# EAGLE design MM7150 (EAGLE 7.7.0)
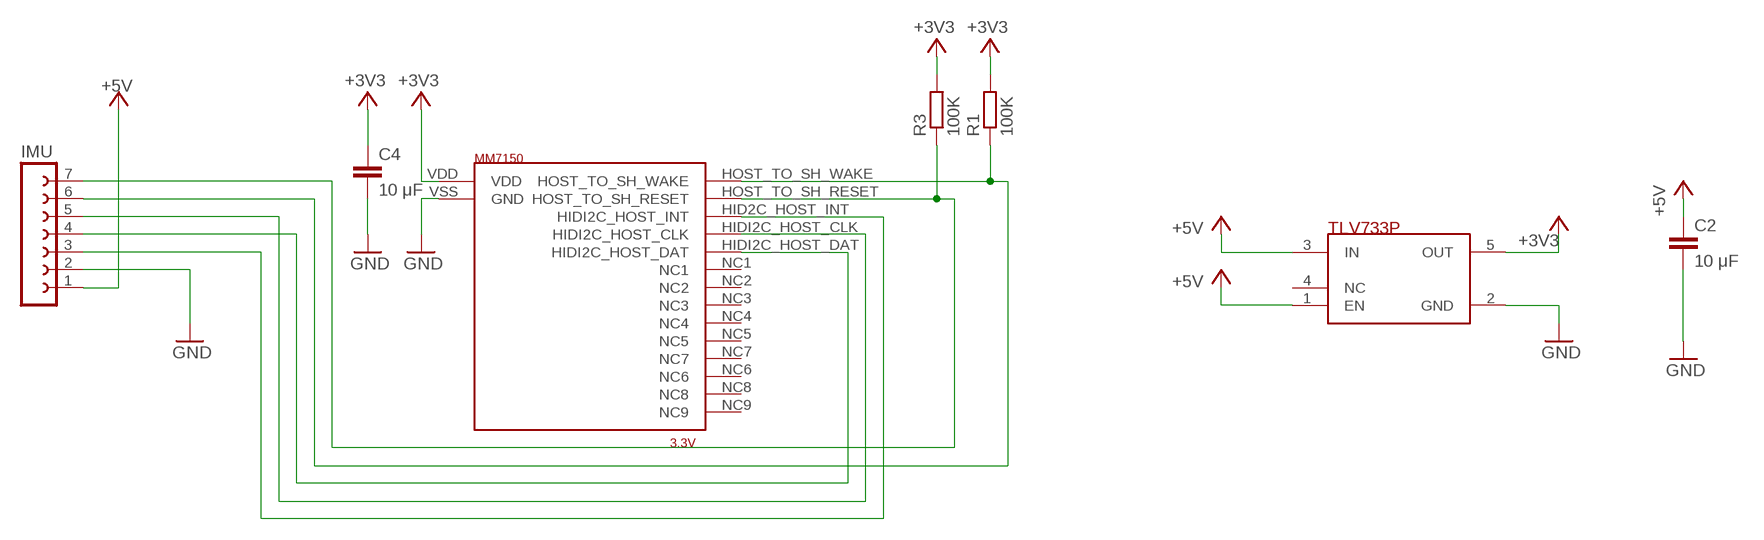
[diagram p0: schematic, sheet 1]

## Parts
C2  10 μF  C-EUC0805  [C0805]
C4  10 μF  C-EUC0805  [C0805]
IMU  FE07-1  [FE07]
R1  100K  R-EU_R2012  [R2012]
R3  100K  R-EU_R2012  [R2012]
U$1  MM7150  [MM7150]
U$2  TLV733P  [SOT23-5]

## Nets
$N3: IMU.3 U$1.HID2C_HOST_INT(HIDI2C_HOST_INT)
$N4: IMU.4 U$1.HIDI2C_HOST_DAT
$N5: IMU.5 U$1.HIDI2C_HOST_CLK
+3V3: C4.1 R1.2 R3.2 U$1.VDD U$2.5(OUT)
+5V: C2.1 IMU.1 U$2.1(EN) U$2.3(IN)
GND: C2.2 C4.2 IMU.2 U$1.VSS(GND) U$2.2(GND)
N$1: IMU.6 R1.1 U$1.HOST_TO_SH_WAKE
N$3: IMU.7 R3.1 U$1.HOST_TO_SH_RESET
Unconnected: U$1.NC1 U$1.NC2 U$1.NC3 U$1.NC4 U$1.NC5 U$1.NC6 U$1.NC7 U$1.NC8 U$1.NC9 U$2.4(NC)

## Library data of the parts
C2 C4 = rcl:C-EU: CAPACITOR, European symbol
IMU = con-lsta:FE07-1: FEMALE HEADER; OC_FARNELL: unknown; OC_NEWARK: unknown
R1 R3 = rcl:R-EU_: RESISTOR, European symbol
U$1 = MM7150:MM7150
U$2 = MM7150:TLV733P

## Board
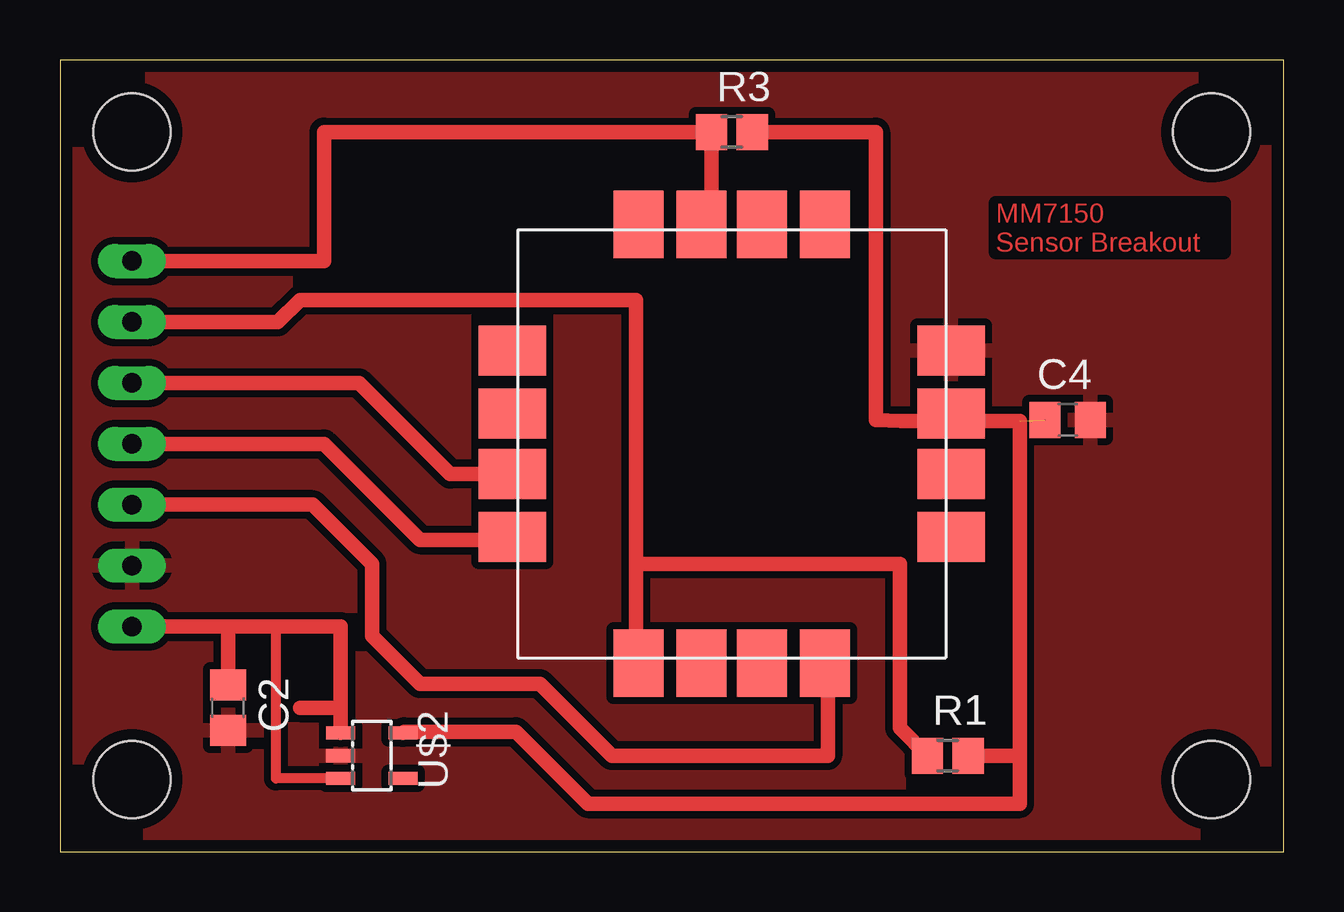
[diagram p1: board, top side]
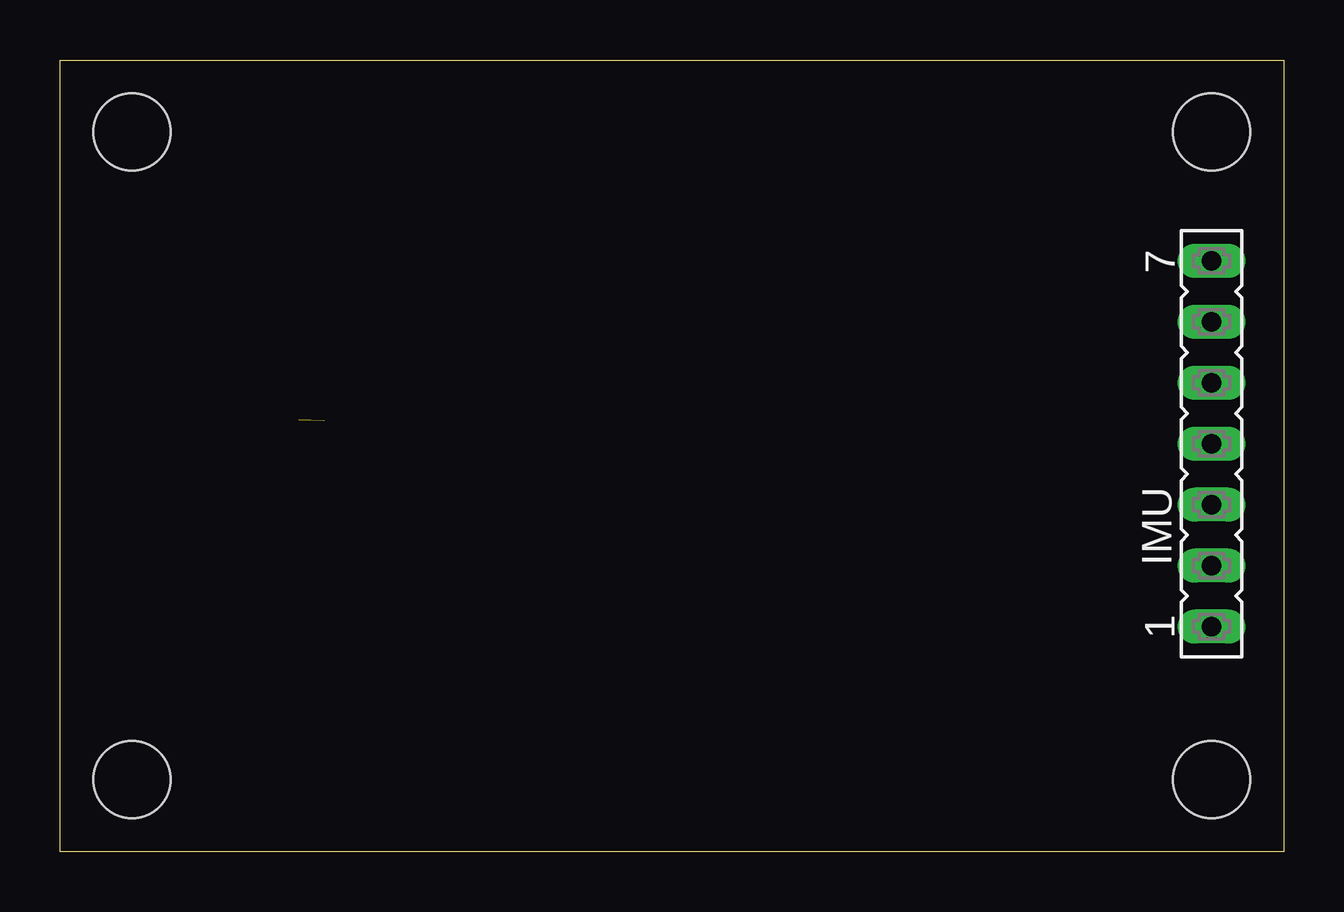
[diagram p2: board, bottom side, seen from below]

Size 51 x 33 mm. Coordinates in mm from the lower left corner, seen from the top.
Outline: 0,0 51,0 51,33 0,33 0,0
Copper layers (1*16): Top 0.035mm / dielectric 1.5mm / Bottom 0.035mm
Design rules "HVA-LPKF": minimum track width 0.3mm, minimum drill 0.6mm, track to track 0.3mm, track to pad 0.3mm, pad to pad 0.3mm, via to via 0.3mm, smd to smd 0.3mm, copper to edge 0.5mm, drill to drill 0.5mm, minimum pad ring 0.3mm, minimum via ring 0.3mm, stop-mask expansion 0.1mm, vias tented up to drill 0mil, thermal gap 0.3mm
Holes 3.2 mm at 3,3 48,3 48,30 3,30

### Footprints (pad centres in the part's own frame; a part is rotated, then mirrored left to right if it is on the bottom)
C0805 = smd 1.3 x 1.5: 1 -0.95,0; 2 0.95,0
FE07 = drill 0.813 long: 1 -7.62,0; 2 -5.08,0; 3 -2.54,0; 4 0,0; 5 2.54,0; 6 5.08,0; 7 7.62,0
R2012 = smd 1.3 x 1.5: 1 -0.85,0; 2 0.85,0
MM7150 = smd 2.08 x 2.8: HID2C_HOST_INT 3.88,-9.144; HOST_TO_SH_RESET -1.265,9.144; HOST_TO_SH_WAKE -3.88,-9.144; NC1 1.265,9.144; NC2 -1.265,-9.144; NC3 3.88,9.144; NC4 -3.88,9.144; NC7 1.265,-9.144 | smd 2.8 x 2.08: HIDI2C_HOST_CLK -9.144,-1.265; HIDI2C_HOST_DAT -9.144,-3.88; NC5 -9.144,3.88; NC6 -9.144,1.265; NC8 9.144,-3.88; NC9 9.144,-1.265; VDD 9.144,1.265; VSS 9.144,3.88
SOT23-5 = smd 0.55 x 1.2: 1 -0.95,-1.3; 2 0,-1.3; 3 0.95,-1.3; 4 0.95,1.3; 5 -0.95,1.3

### Placement (x,y rotation side)
C2  7,6 270 top
C4  42,18 0 top
IMU  3,17 90 bottom
R1  37,4 0 top
R3  28,30 0 top
U$1  28,17 0 top
U$2  13,4 270 top

### Tracks (layer width: path | path; a pad name or v marks a point on that pad's centre or on a via)
$N3
  Top 0.6: U$1.HID2C_HOST_INT 32,7.74 32,4 23,4 20,7 15,7 13,9 13,12 10.54,14.46 IMU.3
$N4
  Top 0.6: IMU.4 11,17 15,13 18.86,13 U$1.HIDI2C_HOST_DAT
$N5
  Top 0.6: U$1.HIDI2C_HOST_CLK 16.27,15.73 12.46,19.54 IMU.5
+3V3  (1 unrouted)
  Top 0.6: 37.46,17.95 40,17.95 40,4 | 37.46,17.95 U$1.VDD | 37.46,17.95 35.05,17.95 34,18 34,30 R3.2 | U$2.5 14.35,5 19,5 22,2 40,2 40,4 | R1.2 40,4
+5V
  Top 0.406: U$2.3 9,3.05 9,9.38
  Top 0.6: IMU.1 7,9.38 | 7,9.38 9,9.38 11.7,9.38 11.7,6 | 11.7,6 U$2.1 | C2.1 7,9.38 | 10,6 11.7,6
GND
  pour Top: 0,0 51,0 51,33 0,33
N$1
  Top 0.6: U$1.HOST_TO_SH_WAKE 24,7.86 24,12 | 24,12 24,23 10,23 9.08,22.08 IMU.6 | R1.1 35,5.15 35,12 24,12
N$3
  Top 0.6: IMU.7 11,24.62 11,30 R3.1 27.15,26.14 U$1.HOST_TO_SH_RESET

### Text on the board
Top: MM7150 / Sensor Breakout